# Altium schematic sheet GPIO_HEADER.SchDoc
size A3; SheetNumber: 21; SheetTotal: 21
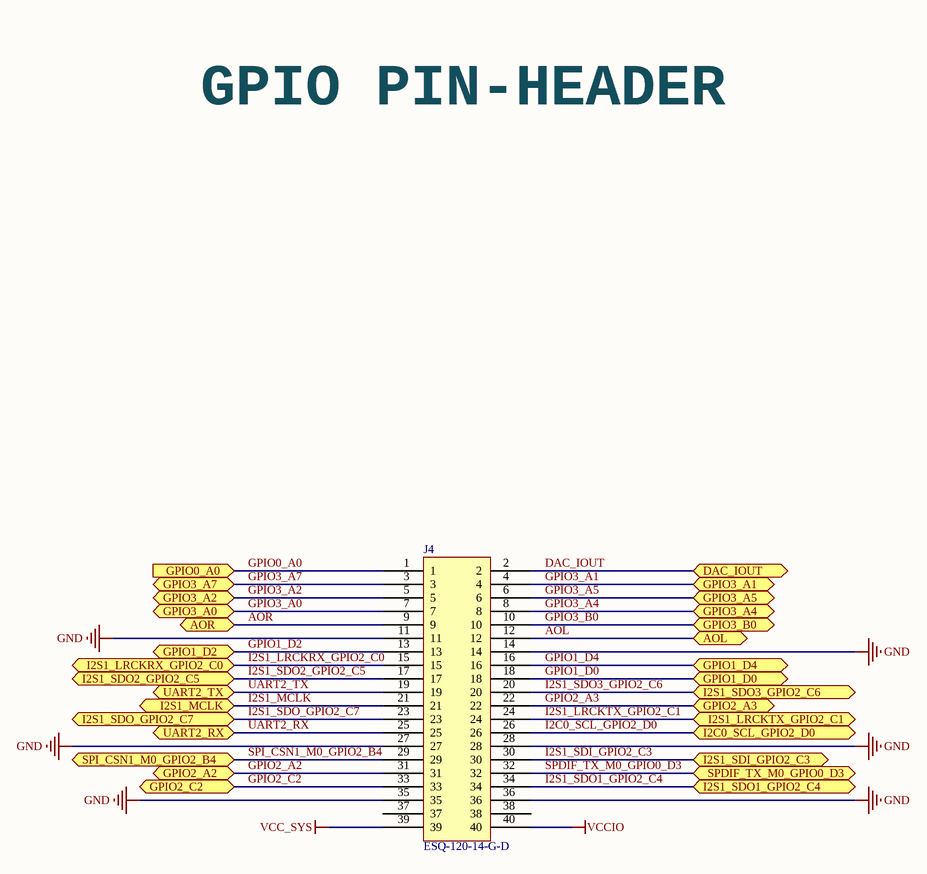
[diagram p0: GPIO_HEADER.SchDoc]

## Parts
J4  ESQ-120-14-G-D  [ESQ-120-14-G-D]

## Ports
AOL (bidir), AOR (bidir), DAC_IOUT (bidir), GPIO0_A0 (in), GPIO1_D0 (bidir), GPIO1_D2 (bidir), GPIO1_D4 (bidir), GPIO2_A2 (bidir), GPIO2_A3 (bidir), GPIO2_C2 (bidir), GPIO3_A0 (bidir), GPIO3_A1 (bidir), GPIO3_A2 (bidir), GPIO3_A4 (bidir), GPIO3_A5 (bidir), GPIO3_A7 (bidir), GPIO3_B0 (bidir), I2C0_SCL_GPIO2_D0 (bidir), I2S1_LRCKRX_GPIO2_C0 (bidir), I2S1_LRCKTX_GPIO2_C1 (bidir), I2S1_MCLK (bidir), I2S1_SDI_GPIO2_C3 (bidir), I2S1_SDO1_GPIO2_C4 (bidir), I2S1_SDO2_GPIO2_C5 (bidir), I2S1_SDO3_GPIO2_C6 (bidir), I2S1_SDO_GPIO2_C7 (bidir), SPDIF_TX_M0_GPIO0_D3 (bidir), SPI_CSN1_M0_GPIO2_B4 (bidir), UART2_RX (bidir), UART2_TX (bidir)

## Nets
GND: J4.11 J4.14 J4.27 J4.28 J4.35 J4.36
VCC_SYS: J4.39
VCCIO: J4.40
AOL: J4.12 ; port AOL
AOR: J4.9 ; port AOR
DAC_IOUT: J4.2 ; port DAC_IOUT
GPIO0_A0: J4.1 ; port GPIO0_A0
GPIO1_D0: J4.18 ; port GPIO1_D0
GPIO1_D2: J4.13 ; port GPIO1_D2
GPIO1_D4: J4.16 ; port GPIO1_D4
GPIO2_A2: J4.31 ; port GPIO2_A2
GPIO2_A3: J4.22 ; port GPIO2_A3
GPIO2_C2: J4.33 ; port GPIO2_C2
GPIO3_A0: J4.7 ; port GPIO3_A0
GPIO3_A1: J4.4 ; port GPIO3_A1
GPIO3_A2: J4.5 ; port GPIO3_A2
GPIO3_A4: J4.8 ; port GPIO3_A4
GPIO3_A5: J4.6 ; port GPIO3_A5
GPIO3_A7: J4.3 ; port GPIO3_A7
GPIO3_B0: J4.10 ; port GPIO3_B0
I2C0_SCL_GPIO2_D0: J4.26 ; port I2C0_SCL_GPIO2_D0
I2S1_LRCKRX_GPIO2_C0: J4.15 ; port I2S1_LRCKRX_GPIO2_C0
I2S1_LRCKTX_GPIO2_C1: J4.24 ; port I2S1_LRCKTX_GPIO2_C1
I2S1_MCLK: J4.21 ; port I2S1_MCLK
I2S1_SDI_GPIO2_C3: J4.30 ; port I2S1_SDI_GPIO2_C3
I2S1_SDO1_GPIO2_C4: J4.34 ; port I2S1_SDO1_GPIO2_C4
I2S1_SDO2_GPIO2_C5: J4.17 ; port I2S1_SDO2_GPIO2_C5
I2S1_SDO3_GPIO2_C6: J4.20 ; port I2S1_SDO3_GPIO2_C6
I2S1_SDO_GPIO2_C7: J4.23 ; port I2S1_SDO_GPIO2_C7
SPDIF_TX_M0_GPIO0_D3: J4.32 ; port SPDIF_TX_M0_GPIO0_D3
SPI_CSN1_M0_GPIO2_B4: J4.29 ; port SPI_CSN1_M0_GPIO2_B4
UART2_RX: J4.25 ; port UART2_RX
UART2_TX: J4.19 ; port UART2_TX

Not connected (* = marked no-connect by the designer): J4 37 38

## Notes on the sheet
- GPIO PIN-HEADER

## Library data of the parts
J4 = ESQ-120-14-G-D: CONN RCPT 40POS .100" DUAL GOLD; Mfr: Samtec Inc.; Connector Type: Receptacle; Number of Positions: 40; Number of Positions Loaded: All; Pitch: 0.100" (2.54mm); .Creator: MM; Supplier 1: Digi-Key; Mfr_Part_No: ESQ-120-14-G-D; RoHS: RoHS Compliant; Category: Connectors, Interconnects; Stock 1: 51; Pricing 1: 1=7.42, 10=6.864, 50=6.1586, 100=5.7505, 250=5.00852, 500=4.823, 1000=4.6375, 2500=4.452 (USD); Packaging: Tube; Contact Type: Female Socket; Number of Rows: 2; Row Spacing: 0.100" (2.54mm); Mounting Type: Through Hole; Termination: Solder; Fastening Type: -; Features: -; Contact Finish: Gold; Contact Finish Thickness: 20µin (0.51µm); Color: Black; ComponentLink1URL: http://suddendocs.samtec.com/prints/esq-1xx-xx-x-x-xxx-xx-x-xx-mkt.pdf; ComponentLink1Description: http://suddendocs.samtec.com/prints/esq-1xx-xx-x-x-xxx-xx-x-xx-mkt.pdf; Supplier Part Number 1: SAM8767-ND; .Checked PCB: MM; .Checked SCH: MM